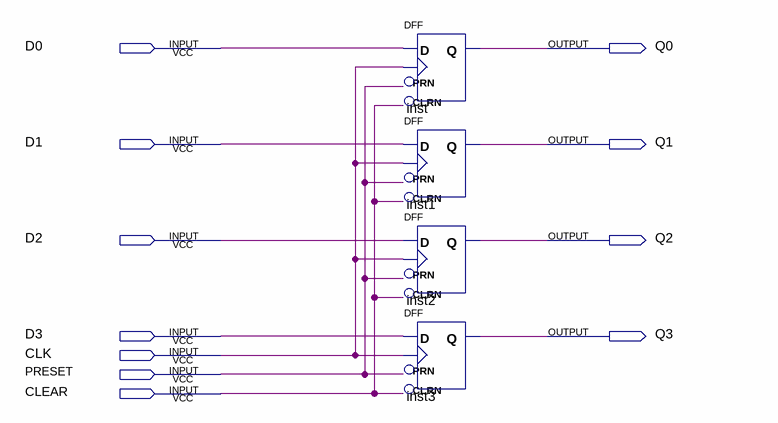
[diagram p0: schematic sheet]
// Quartus schematic PIPO4Bits.bdf as structural Verilog: 4 symbols, 11 pins
module PIPO4Bits (
  input  D0,
  input  D1,
  input  D2,
  input  D3,
  input  CLK,
  input  PRESET,
  input  CLEAR,
  output Q0,
  output Q1,
  output Q2,
  output Q3
);

  DFF inst (.CLRN(CLEAR), .CLK(CLK), .D(D0), .PRN(PRESET), .Q(Q0));
  DFF inst1 (.CLRN(CLEAR), .CLK(CLK), .D(D1), .PRN(PRESET), .Q(Q1));
  DFF inst2 (.CLRN(CLEAR), .CLK(CLK), .D(D2), .PRN(PRESET), .Q(Q2));
  DFF inst3 (.CLRN(CLEAR), .CLK(CLK), .D(D3), .PRN(PRESET), .Q(Q3));
endmodule
